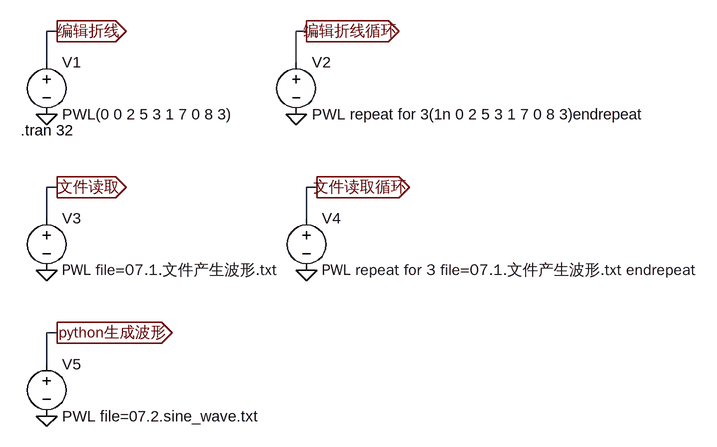
[diagram p0: schematic 07.PWL波形.asc]
07.PWL波形.asc, the LTspice schematic file:
Version 4
SHEET 1 1064 692
WIRE 32 80 16 80
WIRE 416 80 400 80
WIRE 16 128 16 80
WIRE 400 128 400 80
WIRE 32 320 16 320
WIRE 432 320 416 320
WIRE 16 368 16 320
WIRE 416 368 416 320
WIRE 32 544 16 544
WIRE 16 592 16 544
FLAG 16 208 0
FLAG 32 80 编辑折线
IOPIN 32 80 Out
FLAG 400 208 0
FLAG 416 80 编辑折线循环
IOPIN 416 80 Out
FLAG 16 448 0
FLAG 32 320 文件读取
IOPIN 32 320 Out
FLAG 416 448 0
FLAG 432 320 文件读取循环
IOPIN 432 320 Out
FLAG 16 672 0
FLAG 32 544 python生成波形
IOPIN 32 544 Out
SYMBOL voltage 16 112 R0
WINDOW 123 0 0 Left 0
WINDOW 39 0 0 Left 0
SYMATTR InstName V1
SYMATTR Value PWL(0 0 2 5 3 1 7 0 8 3)
SYMBOL voltage 400 112 R0
SYMATTR InstName V2
SYMATTR Value PWL repeat for 3(1n 0 2 5 3 1 7 0 8 3)endrepeat
SYMBOL voltage 16 352 R0
WINDOW 123 0 0 Left 0
WINDOW 39 0 0 Left 0
SYMATTR InstName V3
SYMATTR Value PWL file=07.1.文件产生波形.txt
SYMBOL voltage 416 352 R0
SYMATTR InstName V4
SYMATTR Value PWL repeat for 3 file=07.1.文件产生波形.txt endrepeat
SYMBOL voltage 16 576 R0
WINDOW 123 0 0 Left 0
WINDOW 39 0 0 Left 0
SYMATTR InstName V5
SYMATTR Value PWL file=07.2.sine_wave.txt
TEXT -24 232 Left 2 !.tran 32

The netlist it stands for:
* 07.PWL波形.asc
V1 编辑折线 0 PWL(0 0 2 5 3 1 7 0 8 3)
V2 编辑折线循环 0 PWL repeat for 3(1n 0 2 5 3 1 7 0 8 3)endrepeat
V3 文件读取 0 PWL file=07.1.文件产生波形.txt
V4 文件读取循环 0 PWL repeat for 3 file=07.1.文件产生波形.txt endrepeat
V5 python生成波形 0 PWL file=07.2.sine_wave.txt
.tran 32
.backanno
.end